# Altium schematic sheet mcu.SchDoc
size A3
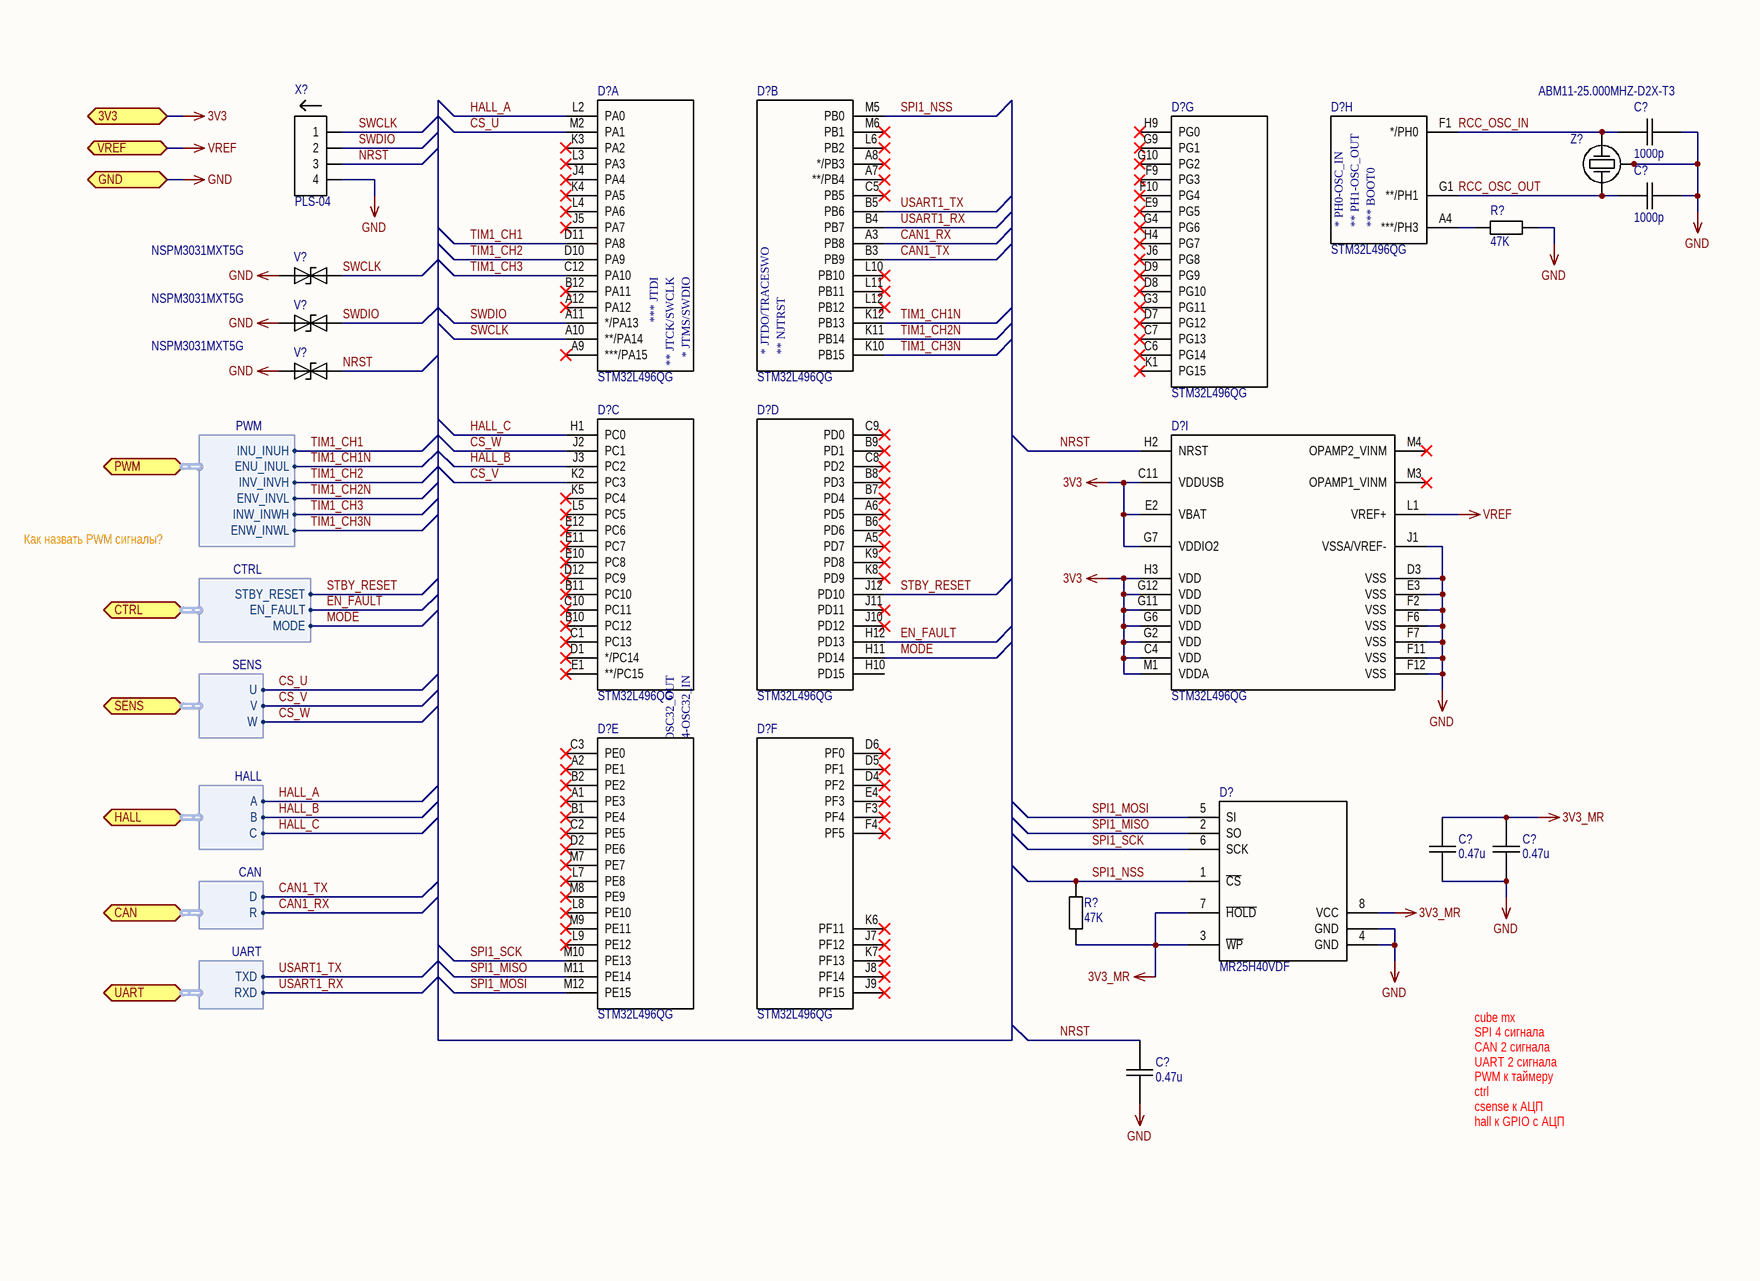
[diagram p0: mcu.SchDoc, right]

## Parts
(Parts that share a designator on the sheet are numbered #1, #2 ... from top to bottom, then left to right.)
C?#1  value 1000p  [CAP-0402]  (hidden comment: CAP-1000p-5%-50V-NP0-0402)
C?#2  value 1000p  [CAP-0402]  (hidden comment: CAP-1000p-5%-50V-NP0-0402)
C?#3  value 0.47u  [CAP-0402]  (hidden comment: CAP-0.47u-10%-50V-X7R-0402)
C?#4  value 0.47u  [CAP-0402]  (hidden comment: CAP-0.47u-10%-50V-X7R-0402)
C?#5  value 0.47u  [CAP-0402]  (hidden comment: CAP-0.47u-10%-50V-X7R-0402)
D?#1  STM32L496QG  [UFBGA132]  (part A of 9)
D?#2  STM32L496QG  [UFBGA132]  (part B of 9)
D?#3  STM32L496QG  [UFBGA132]  (part G of 9)
D?#4  STM32L496QG  [UFBGA132]  (part H of 9)
D?#5  STM32L496QG  [UFBGA132]  (part C of 9)
D?#6  STM32L496QG  [UFBGA132]  (part D of 9)
D?#7  STM32L496QG  [UFBGA132]  (part I of 9)
D?#8  STM32L496QG  [UFBGA132]  (part E of 9)
D?#9  STM32L496QG  [UFBGA132]  (part F of 9)
D?#10  MR25H40VDF  [DFN-8-5x6-SMALL_FLAG - duplicate]
R?#1  value 47K  [RES-0402]  (hidden comment: RES-47K-1%-0.063-0402)
R?#2  value 47K  [RES-0402]  (hidden comment: RES-47K-1%-0.063-0402)
V?#1  NSPM3031MXT5G  [X2DFN-2]
V?#2  NSPM3031MXT5G  [X2DFN-2]
V?#3  NSPM3031MXT5G  [X2DFN-2]
X?  PLS-04  [PLS-04]
Z?  ABM11-25.000MHZ-D2X-T3  [ABM11]

## Ports
3V3 (bidir), CAN (bidir, harness CAN), CTRL (bidir, harness CTRL), GND (bidir), HALL (bidir, harness HALL), PWM (bidir, harness PWM), SENS (bidir, harness SENS), UART (bidir, harness UART), VREF (bidir)

## Harnesses
CTRL: STBY_RESET, EN_FAULT, MODE
SENS: U, V, W
HALL: A, B, C
CAN: D, R
UART: TXD, RXD
PWM: INU_INUH, ENU_INUL, INV_INVH, ENV_INVL, INW_INWH, ENW_INWL

## Nets
3V3: D?#7.C4(VDD) D?#7.C11(VDDUSB) D?#7.E2(VBAT) D?#7.G2(VDD) D?#7.G6(VDD) D?#7.G7(VDDIO2) D?#7.G11(VDD) D?#7.G12(VDD) D?#7.H3(VDD) D?#7.M1(VDDA) ; port 3V3
3V3_MR: C?#3.2 C?#4.2 D?#10.3(~{WP}) D?#10.7(~{HOLD}) D?#10.8(VCC) R?#2.1
GND: C?#1.2 C?#2.2 C?#3.1 C?#4.1 C?#5.1 D?#7.D3(VSS) D?#7.E3(VSS) D?#7.F2(VSS) D?#7.F6(VSS) D?#7.F7(VSS) D?#7.F11(VSS) D?#7.F12(VSS) D?#7.J1(VSSA/VREF-) D?#10.4(GND) D?#10.PAD(GND) R?#1.2 V?#1.1 V?#2.1 V?#3.1 X?.4 Z?.2 Z?.4 ; port GND
VREF: D?#7.L1(VREF+) ; port VREF
CAN1_RX: D?#2.A3(PB8) ; port CAN.R
CAN1_TX: D?#2.B3(PB9) ; port CAN.D
CS_U: D?#1.M2(PA1) ; port SENS.U
CS_V: D?#5.K2(PC3) ; port SENS.V
CS_W: D?#5.J2(PC1) ; port SENS.W
EN_FAULT: D?#6.H12(PD13) ; port CTRL.EN_FAULT
HALL_A: D?#1.L2(PA0) ; port HALL.A
HALL_B: D?#5.J3(PC2) ; port HALL.B
HALL_C: D?#5.H1(PC0) ; port HALL.C
MODE: D?#6.H11(PD14) ; port CTRL.MODE
NRST: C?#5.2 D?#7.H2(NRST) V?#3.2 X?.3
RCC_OSC_IN: C?#1.1 D?#4.F1(*/PH0) Z?.3
RCC_OSC_OUT: C?#2.1 D?#4.G1(**/PH1) Z?.1
SPI1_MISO: D?#8.M11(PE14) D?#10.2(SO)
SPI1_MOSI: D?#8.M12(PE15) D?#10.5(SI)
SPI1_NSS: D?#2.M5(PB0) D?#10.1(~{CS}) R?#2.2
SPI1_SCK: D?#8.M10(PE13) D?#10.6(SCK)
STBY_RESET: D?#6.J12(PD10) ; port CTRL.STBY_RESET
SWCLK: D?#1.A10(**/PA14) V?#1.2 X?.1
SWDIO: D?#1.A11(*/PA13) V?#2.2 X?.2
TIM1_CH1: D?#1.D11(PA8) ; port PWM.INU_INUH
TIM1_CH1N: D?#2.K12(PB13) ; port PWM.ENU_INUL
TIM1_CH2: D?#1.D10(PA9) ; port PWM.INV_INVH
TIM1_CH2N: D?#2.K11(PB14) ; port PWM.ENV_INVL
TIM1_CH3: D?#1.C12(PA10) ; port PWM.INW_INWH
TIM1_CH3N: D?#2.K10(PB15) ; port PWM.ENW_INWL
USART1_RX: D?#2.B4(PB7) ; port UART.RXD
USART1_TX: D?#2.B5(PB6) ; port UART.TXD
NetD?#4_A4: D?#4.A4(***/PH3) R?#1.1

Not connected (* = marked no-connect by the designer): D?#1 A9(***/PA15)* A12(PA12)* B12(PA11)* J4(PA4)* J5(PA7)* K3(PA2)* K4(PA5)* L3(PA3)* L4(PA6)*; D?#2 A7(**/PB4)* A8(*/PB3)* C5(PB5)* L6(PB2)* L10(PB10)* L11(PB11)* L12(PB12)* M6(PB1)*; D?#3 C6(PG14)* C7(PG13)* D7(PG12)* D8(PG10)* D9(PG9)* E9(PG5)* F9(PG3)* F10(PG4)* G3(PG11)* G4(PG6)* G9(PG1)* G10(PG2)* H4(PG7)* H9(PG0)* J6(PG8)* K1(PG15)*; D?#5 B10(PC12)* B11(PC10)* C1(PC13)* C10(PC11)* D1(*/PC14)* D12(PC9)* E1(**/PC15)* E10(PC8)* E11(PC7)* E12(PC6)* K5(PC4)* L5(PC5)*; D?#6 A5(PD7)* A6(PD5)* B6(PD6)* B7(PD4)* B8(PD3)* B9(PD1)* C8(PD2)* C9(PD0)* H10(PD15) J10(PD12)* J11(PD11)* K8(PD9)* K9(PD8)*; D?#7 M3(OPAMP1_VINM)* M4(OPAMP2_VINM)*; D?#8 A1(PE3)* A2(PE1)* B1(PE4)* B2(PE2)* C2(PE5)* C3(PE0)* D2(PE6)* L7(PE8)* L8(PE10)* L9(PE12)* M7(PE7)* M8(PE9)* M9(PE11)*; D?#9 D4(PF2)* D5(PF1)* D6(PF0)* E4(PF3)* F3(PF4)* F4(PF5)* J7(PF12)* J8(PF14)* J9(PF15)* K6(PF11)* K7(PF13)*

## Notes on the sheet
- Как назвать PWM сигналы?
- cube mx
  SPI 4 сигнала
  CAN 2 сигнала
  UART 2 сигнала
  PWM к таймеру
  ctrl
  csense к АЦП
  hall к GPIO с АЦП
- (in symbol STM32L496QG, part A) *** JTDI; ** JTCK/SWCLK; * JTMS/SWDIO
- (in symbol STM32L496QG, part B) * JTDO/TRACESWO; ** NJTRST
- (in symbol STM32L496QG, part C) ** PC15-OSC32_OUT; * PC14-OSC32_IN
- (in symbol STM32L496QG, part H) * PH0-OSC_IN; ** PH1-OSC_OUT; *** BOOT0

## Library data of the parts
C?#1 C?#2 = CAP-0402: Конденсатор; Tolerance: 5; Voltage: 50; Part Number: *; Manufacturer: *; Temperature: NP0
C?#3-C?#5 = CAP-0402: Конденсатор; Tolerance: 10; Voltage: 50; Part Number: *; Manufacturer: *; Temperature: X7R
D?#1-D?#9 = STM32L496QG: Интегральная микросхема; Manufacturer: ST; Part Number: STM32L496QG
D?#10 = MR25H40: Интегральная микросхема, SPI MRAM; Manufacturer: Everspin; Part Number: MR25H40VDF
R?#1 R?#2 = RES-0402: Резистор; Tolerance: 1; Power: 0.063; Part Number: *; Manufacturer: *
V?#1-V?#3 = NSPM3031: Диод подавления ESD; Manufacturer: *; Tolerance: *; Power: *; Part Number: NSPM3031MXT5G
Z? = ABM11-25MHZ: Резонатор кварцевый; Value: *; Manufacturer: *; Tolerance: *; Part Number: ABM11-25.000MHZ-D2X-T3
X? = PLS-04: Manufacturer: *; Part Number: PLS-04